# Altium schematic sheet 0257_GPU_GDDR_VCCSAMC_V.SchDoc
size 848 x 558 mm
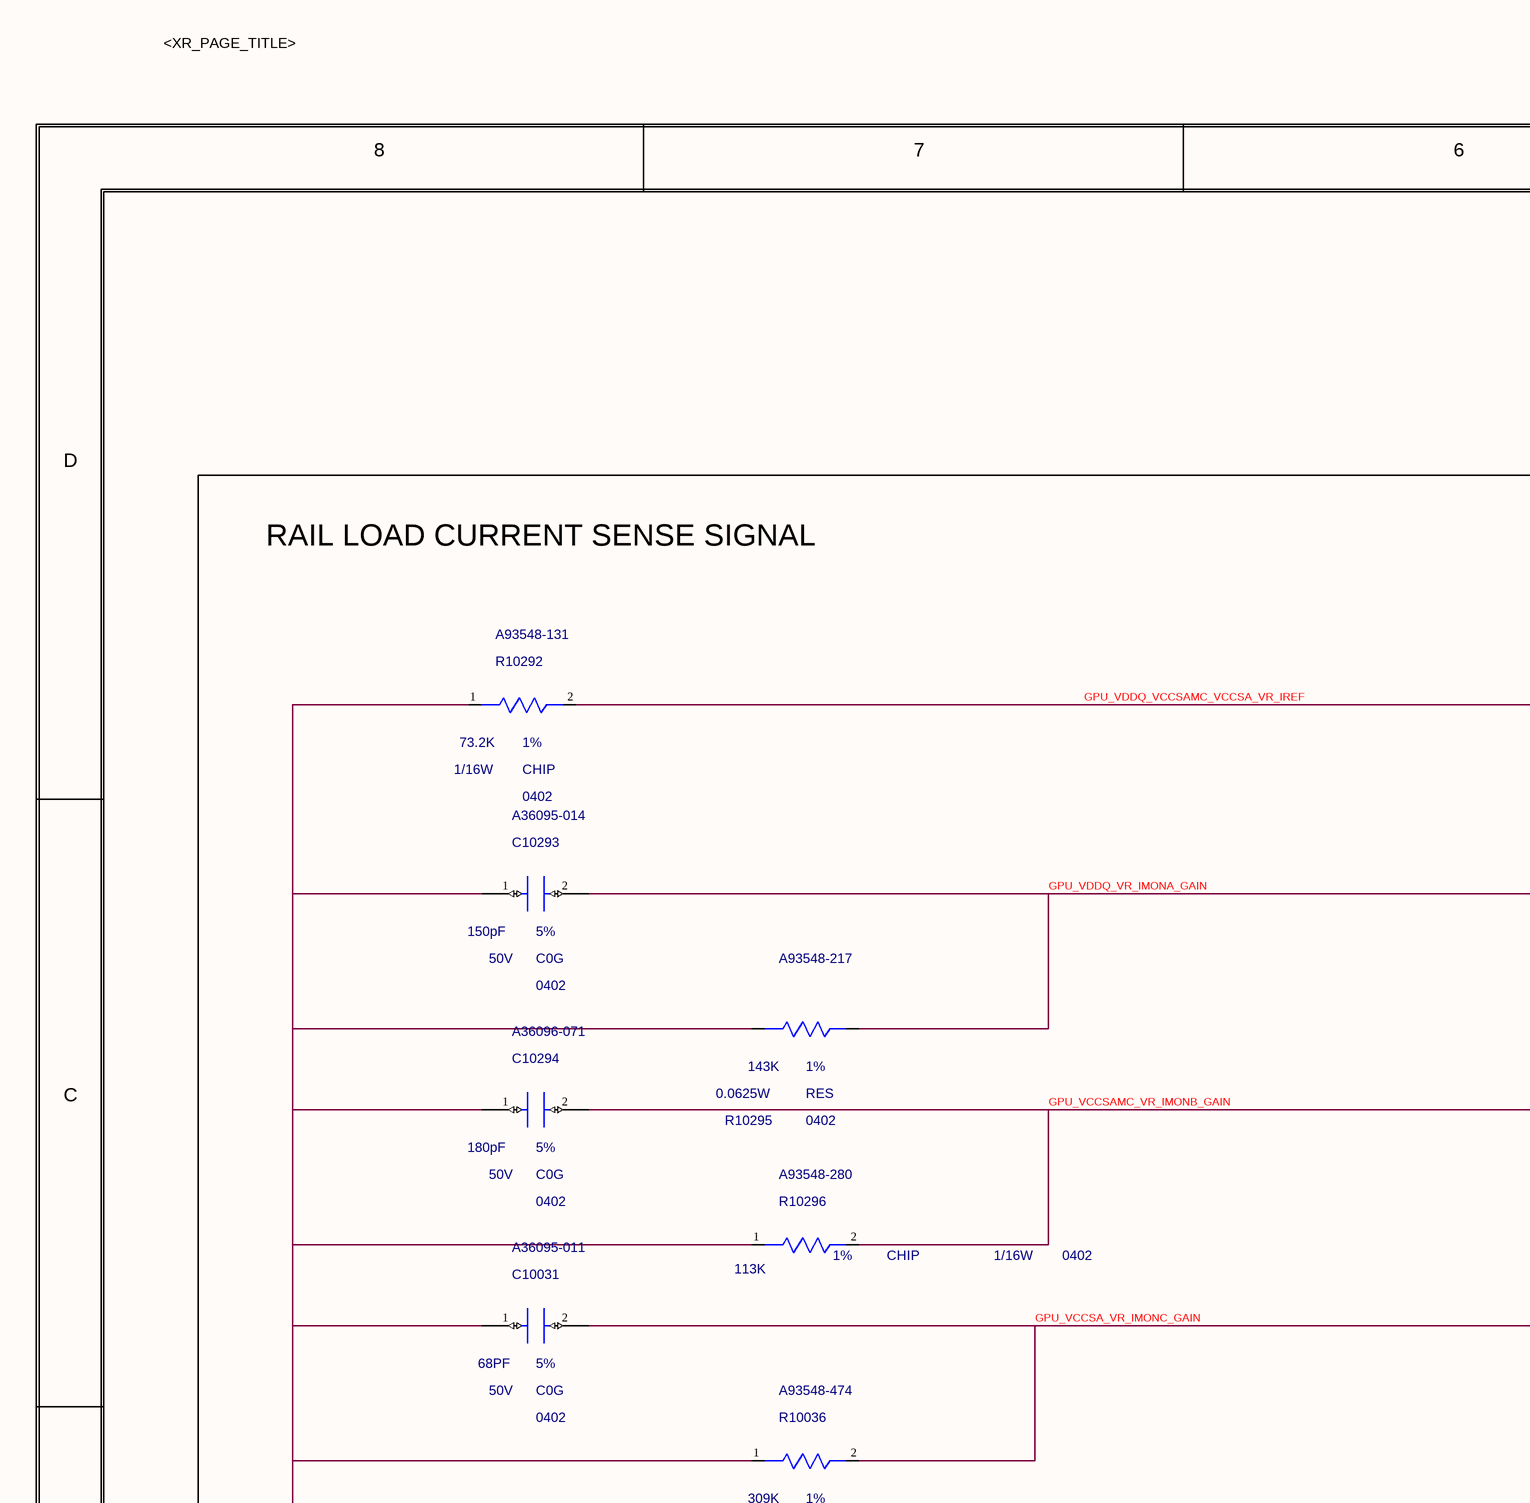
[diagram p0: 0257_GPU_GDDR_VCCSAMC_V.SchDoc, top left]
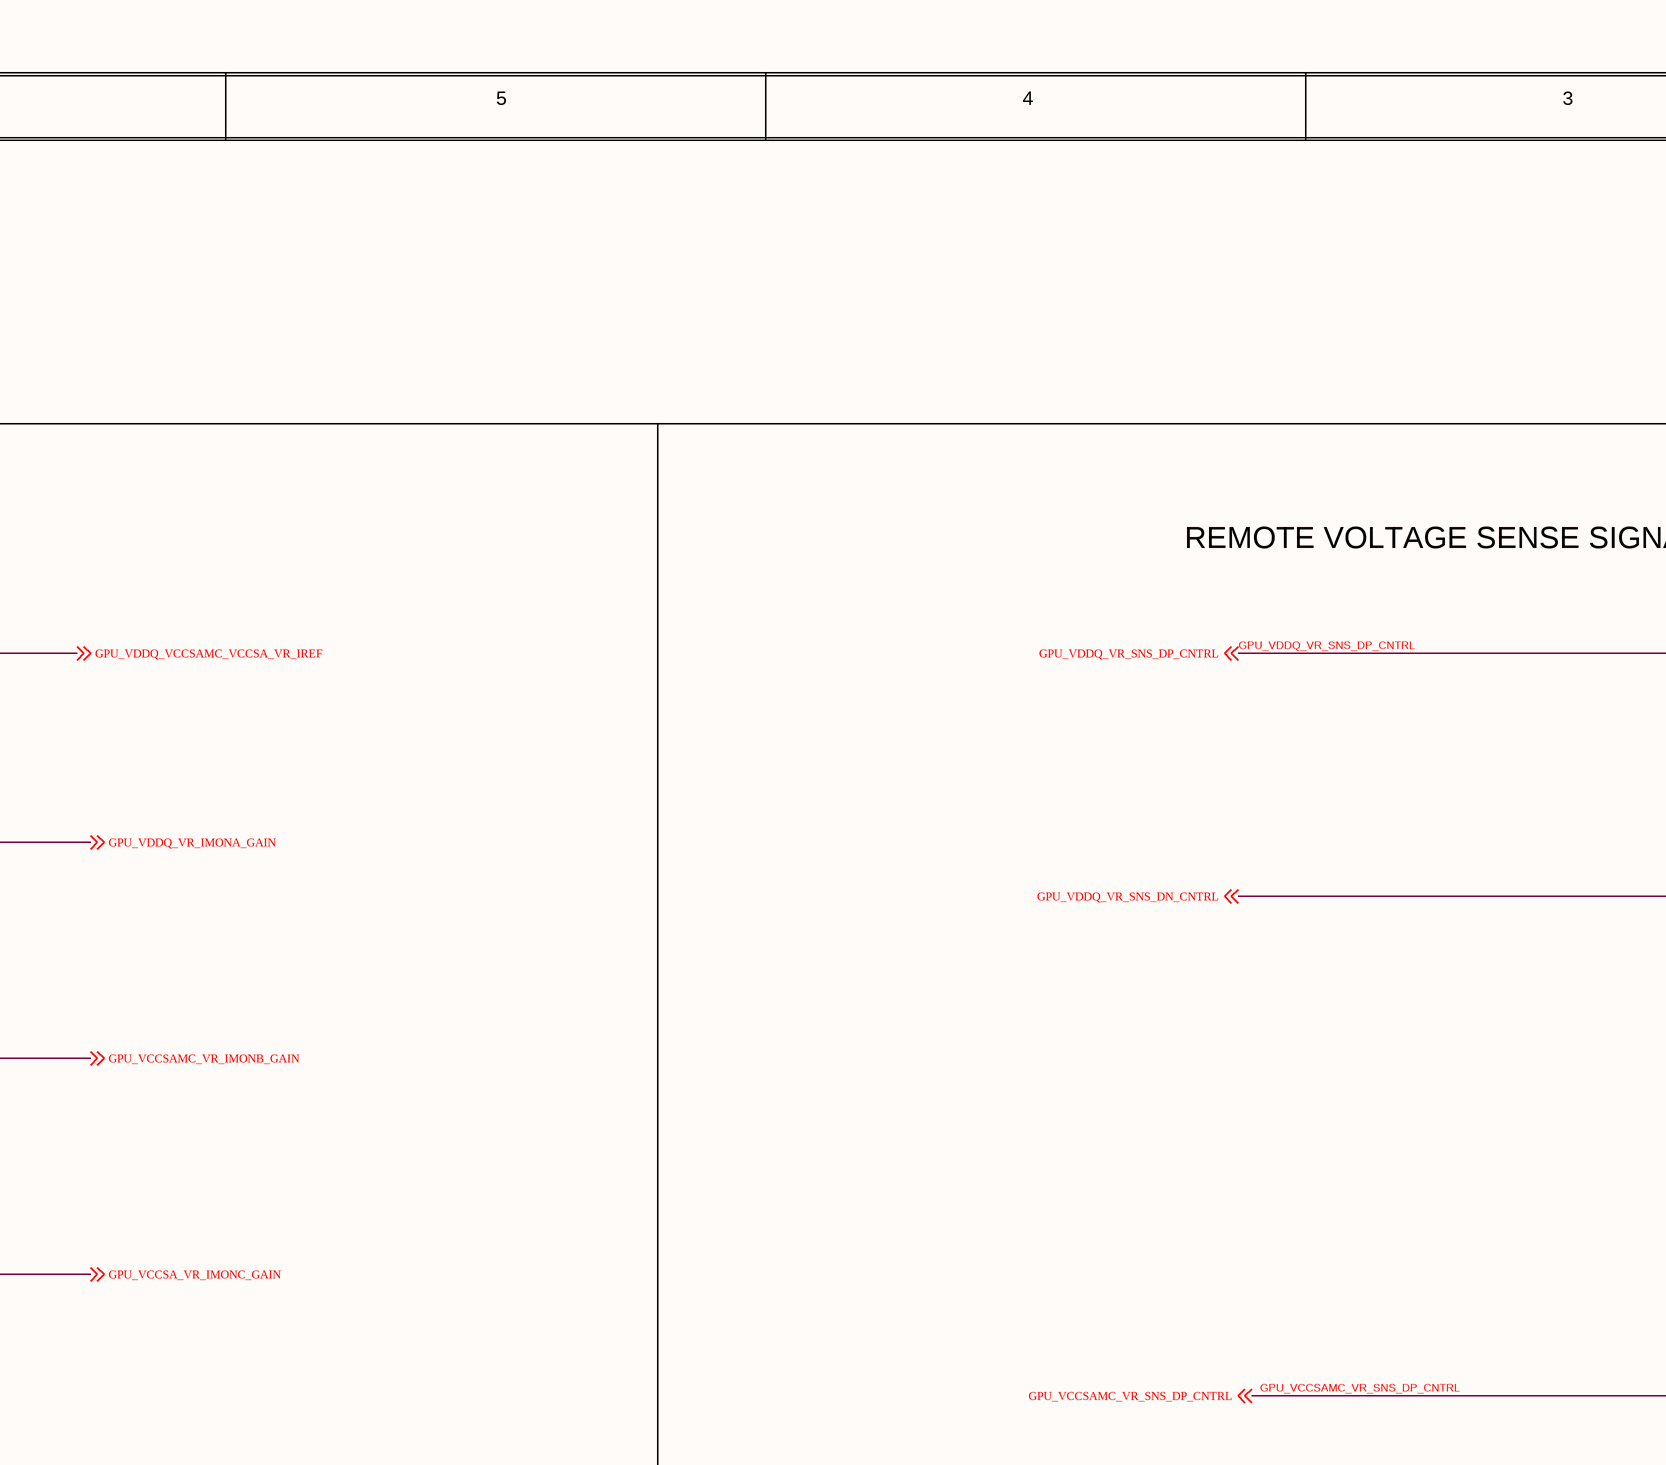
[diagram p1: 0257_GPU_GDDR_VCCSAMC_V.SchDoc, top middle]
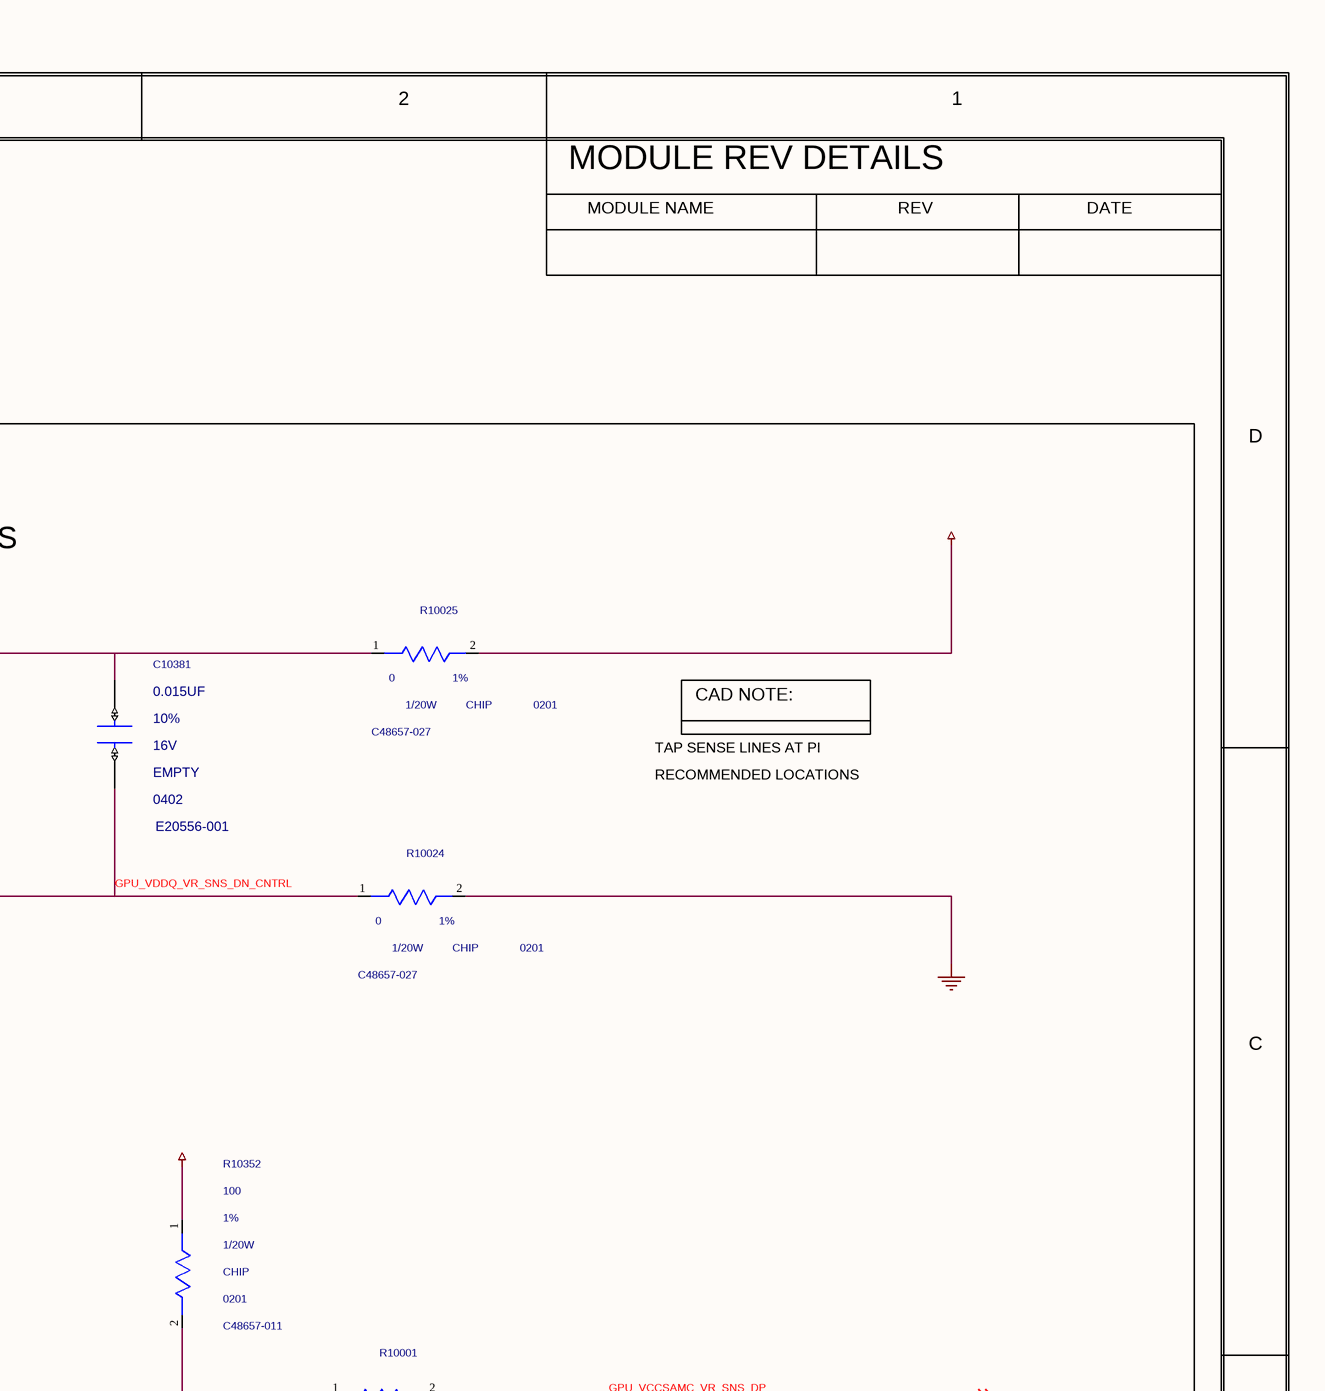
[diagram p2: 0257_GPU_GDDR_VCCSAMC_V.SchDoc, top right]
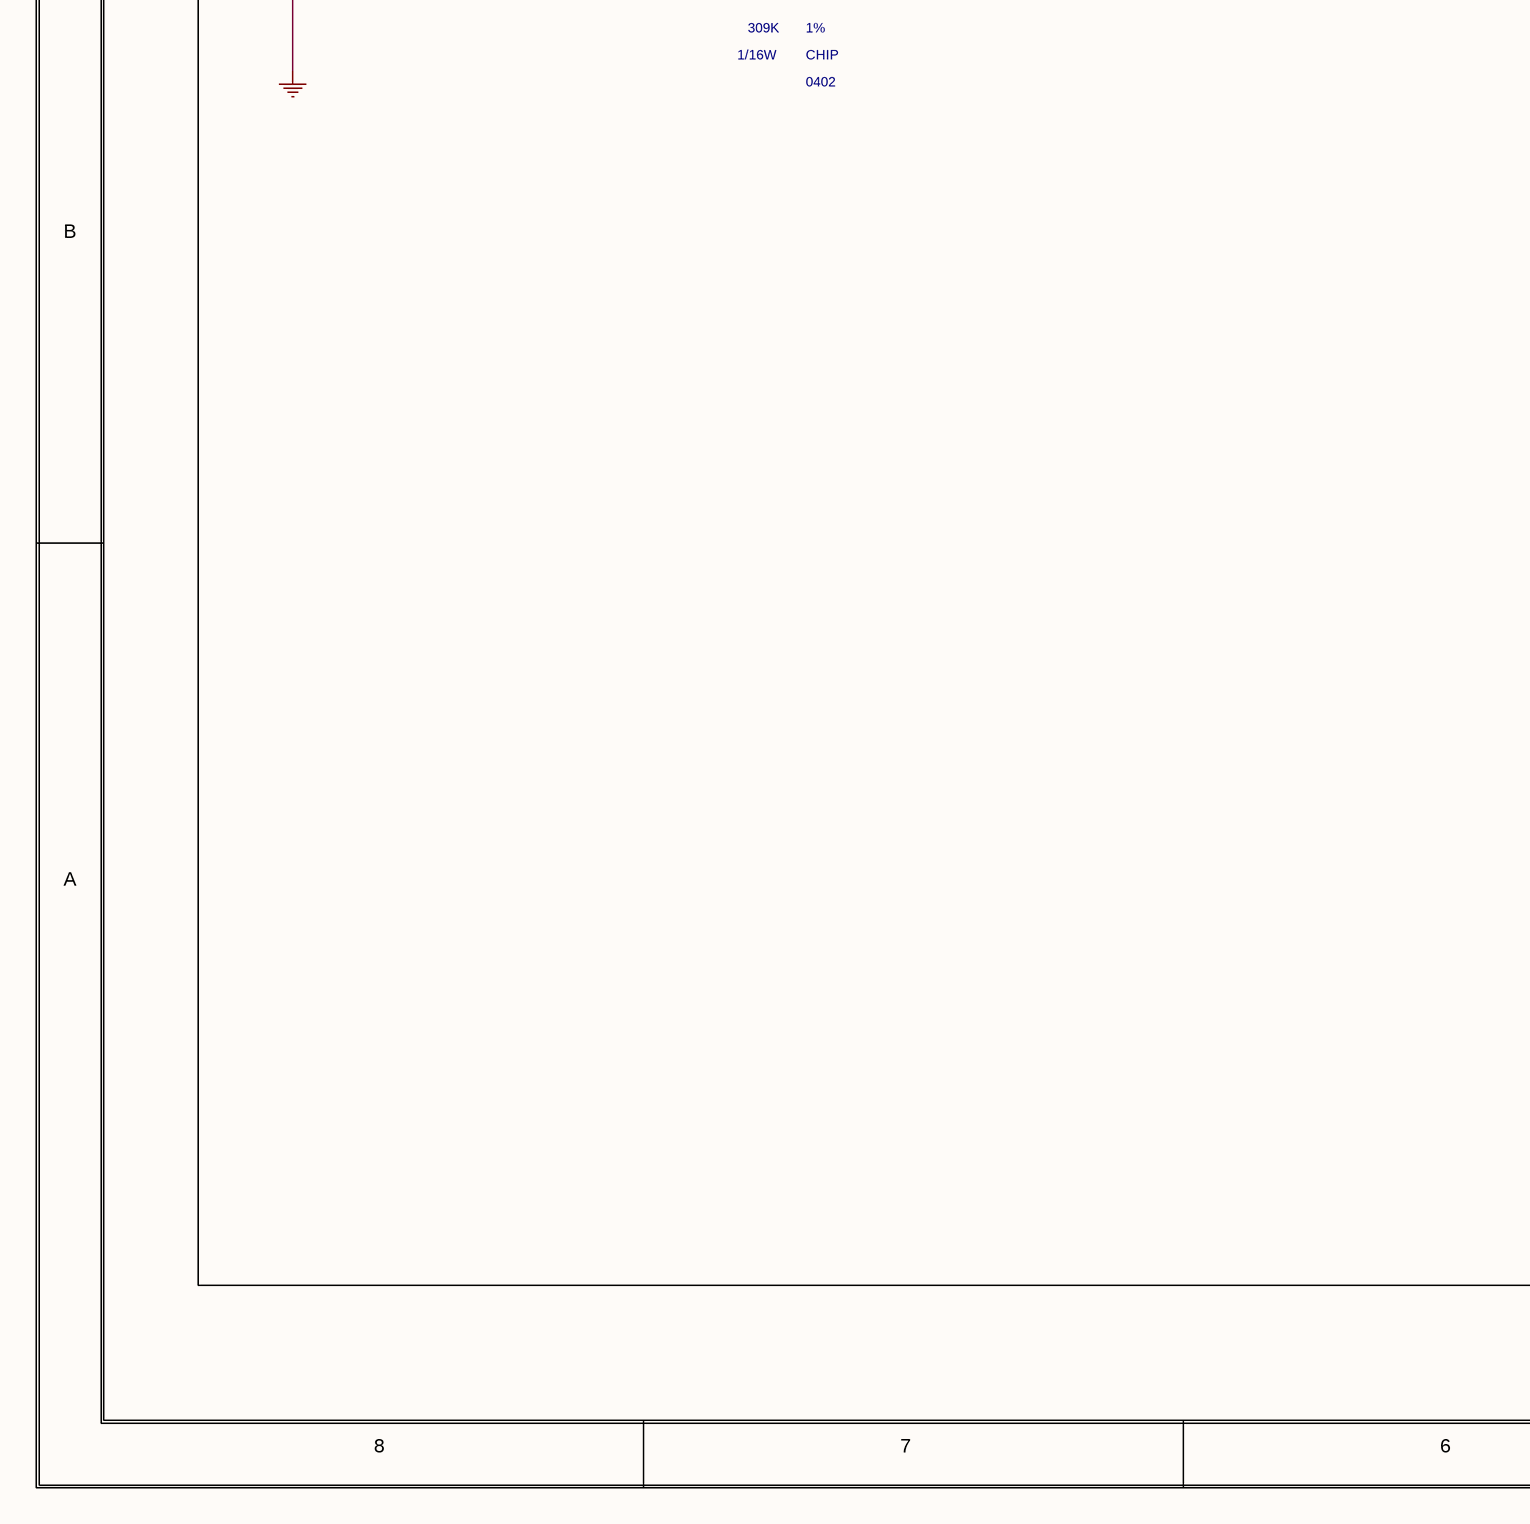
[diagram p3: 0257_GPU_GDDR_VCCSAMC_V.SchDoc, bottom left]
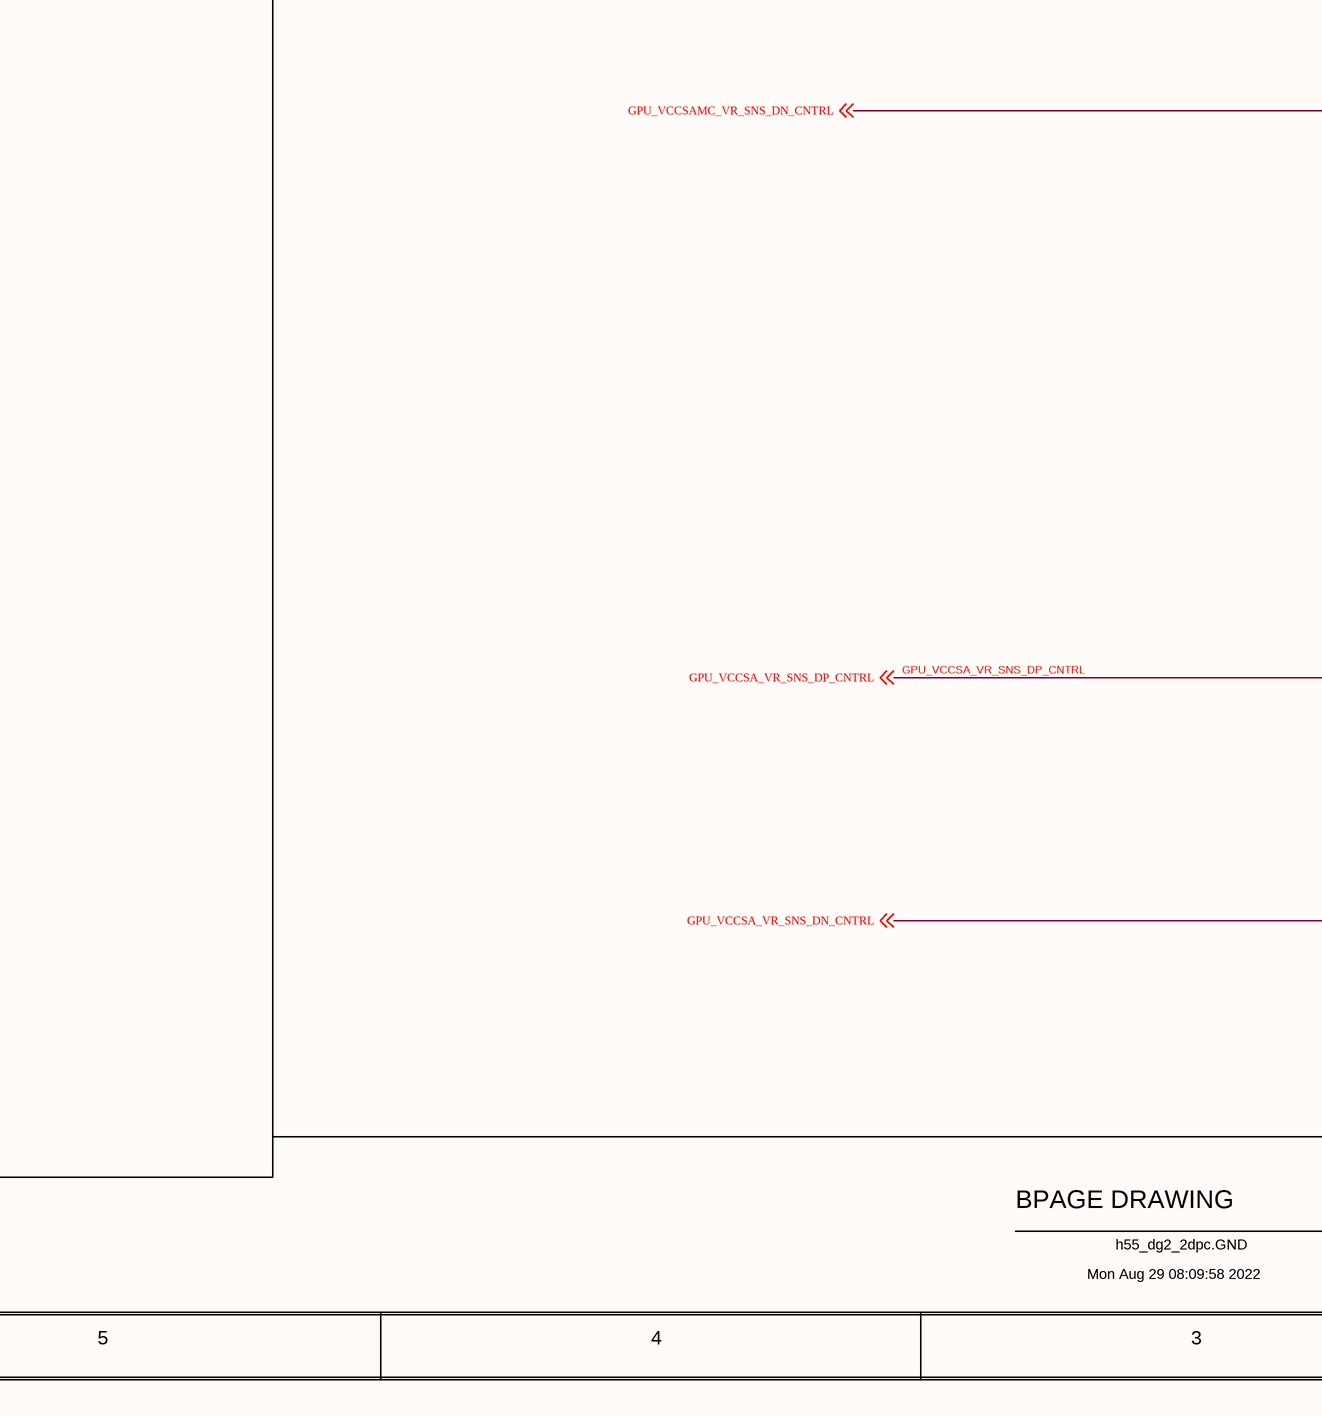
[diagram p4: 0257_GPU_GDDR_VCCSAMC_V.SchDoc, bottom middle]
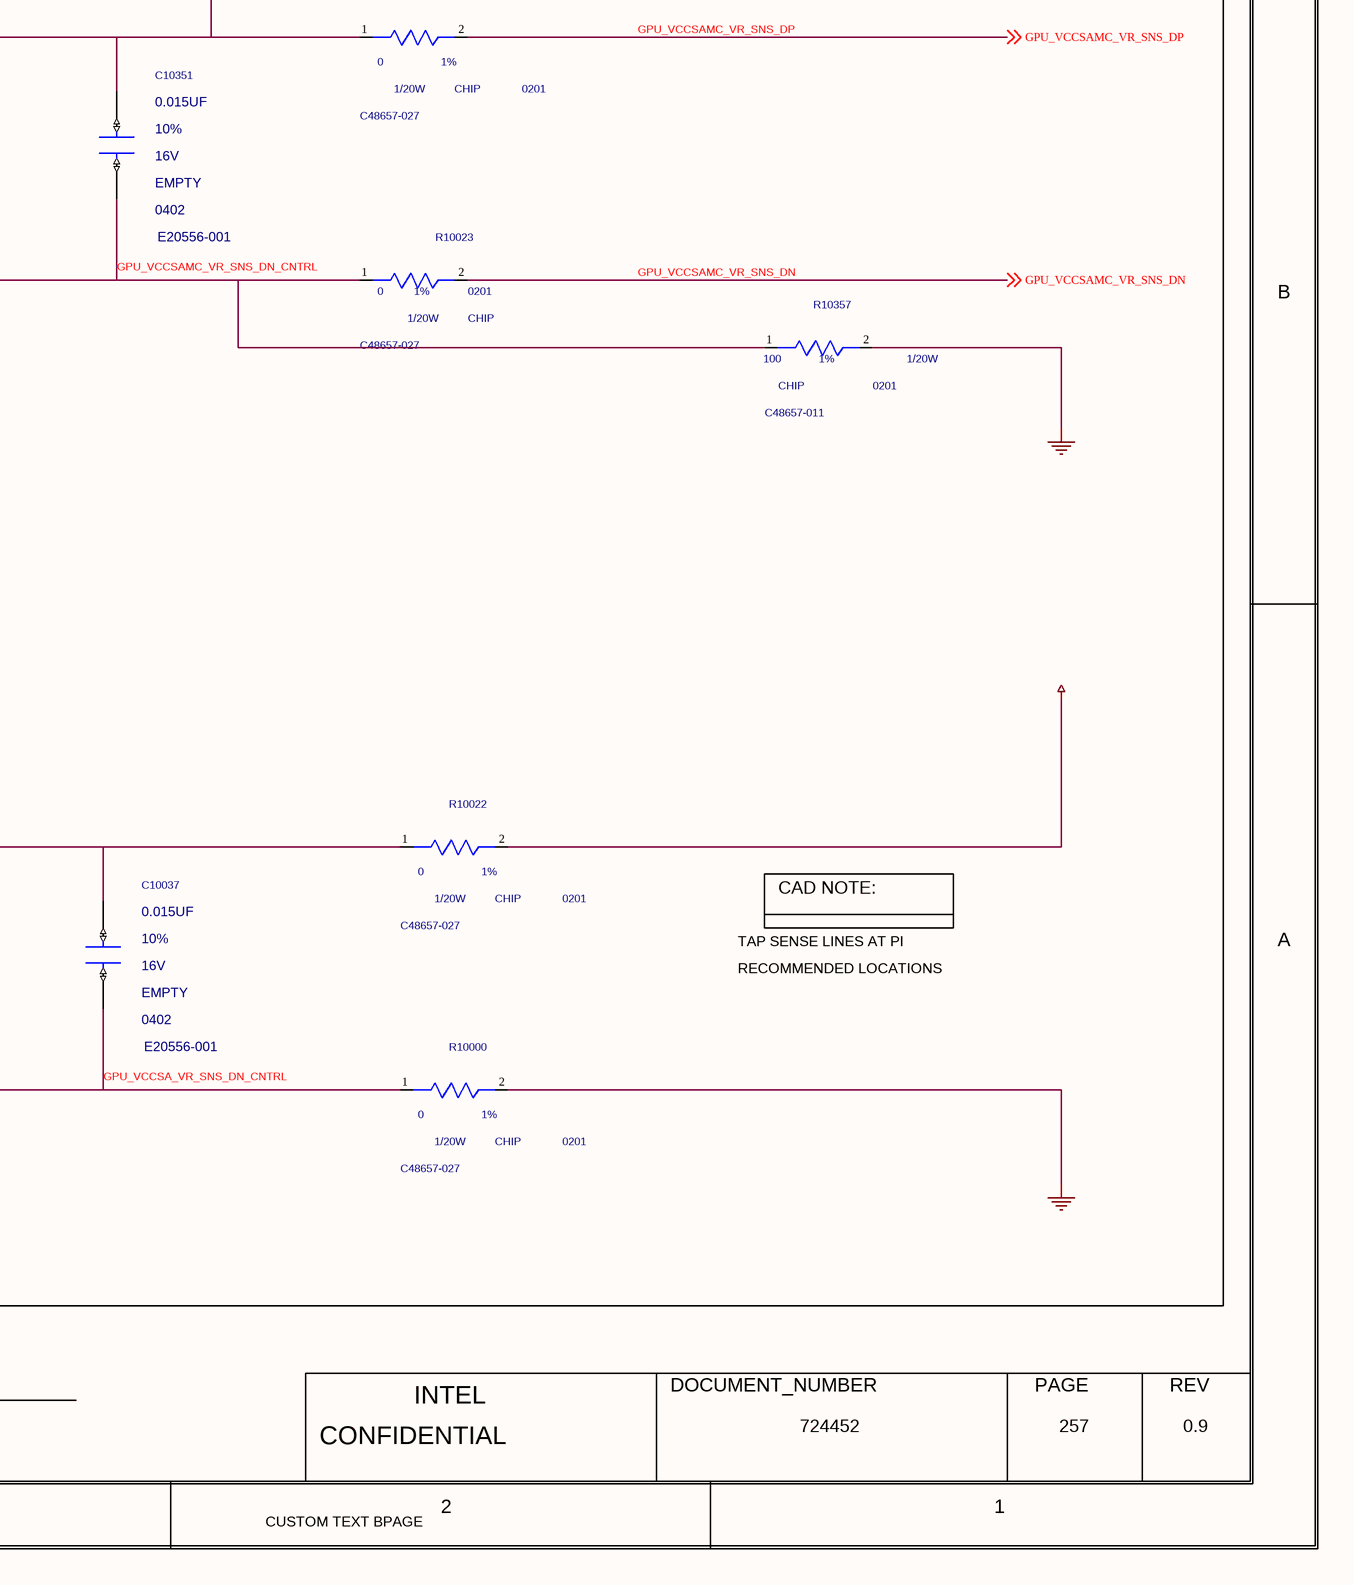
[diagram p5: 0257_GPU_GDDR_VCCSAMC_V.SchDoc, bottom right]

## Parts
C10031  68PF  MATERIAL: C0G  PACK_TYPE: 0402  PART_NUMBER: A36095-011  TOLERANCE: 5%  VOLTAGE: 50V  [SMC0402IA]
C10037  0.015UF  MATERIAL: EMPTY  PACK_TYPE: 0402  PART_NUMBER: E20556-001  TOLERANCE: 10%  VOLTAGE: 16V  [CTK0_SM0402_1050X550_MA]
C10293  150pF  MATERIAL: C0G  PACK_TYPE: 0402  PART_NUMBER: A36095-014  TOLERANCE: 5%  VOLTAGE: 50V  [SMC0402IA]
C10294  180pF  MATERIAL: C0G  PACK_TYPE: 0402  PART_NUMBER: A36096-071  TOLERANCE: 5%  VOLTAGE: 50V  [SMC1005MB]
C10351  0.015UF  MATERIAL: EMPTY  PACK_TYPE: 0402  PART_NUMBER: E20556-001  TOLERANCE: 10%  VOLTAGE: 16V  [CTK0_SM0402_1050X550_MA]
C10381  0.015UF  MATERIAL: EMPTY  PACK_TYPE: 0402  PART_NUMBER: E20556-001  TOLERANCE: 10%  VOLTAGE: 16V  [CTK0_SM0402_1050X550_MA]
R10000  0  MATERIAL: CHIP  PACK_TYPE: 0201  PART_NUMBER: C48657-027  TOLERANCE: 1%  WATTAGE: 1/20W  [SMR0201IA]
R10001  0  MATERIAL: CHIP  PACK_TYPE: 0201  PART_NUMBER: C48657-027  TOLERANCE: 1%  WATTAGE: 1/20W  [SMR0201IA]
R10022  0  MATERIAL: CHIP  PACK_TYPE: 0201  PART_NUMBER: C48657-027  TOLERANCE: 1%  WATTAGE: 1/20W  [SMR0201IA]
R10023  0  MATERIAL: CHIP  PACK_TYPE: 0201  PART_NUMBER: C48657-027  TOLERANCE: 1%  WATTAGE: 1/20W  [SMR0201IA]
R10024  0  MATERIAL: CHIP  PACK_TYPE: 0201  PART_NUMBER: C48657-027  TOLERANCE: 1%  WATTAGE: 1/20W  [SMR0201IA]
R10025  0  MATERIAL: CHIP  PACK_TYPE: 0201  PART_NUMBER: C48657-027  TOLERANCE: 1%  WATTAGE: 1/20W  [SMR0201IA]
R10036  309K  MATERIAL: CHIP  PACK_TYPE: 0402  PART_NUMBER: A93548-474  TOLERANCE: 1%  WATTAGE: 1/16W  [SMR0402IA]
R10292  73.2K  MATERIAL: CHIP  PACK_TYPE: 0402  PART_NUMBER: A93548-131  TOLERANCE: 1%  WATTAGE: 1/16W  [SMR0402IA]
R10295  143K  MATERIAL: RES  PACK_TYPE: 0402  PART_NUMBER: A93548-217  TOLERANCE: 1%  WATTAGE: 0.0625W  [CTK2_SM0402_1100X550_MA]
R10296  113K  MATERIAL: CHIP  PACK_TYPE: 0402  PART_NUMBER: A93548-280  TOLERANCE: 1%  WATTAGE: 1/16W  [SMR0402IA]
R10352  100  MATERIAL: CHIP  PACK_TYPE: 0201  PART_NUMBER: C48657-011  TOLERANCE: 1%  WATTAGE: 1/20W  [SMR0201IA]
R10357  100  MATERIAL: CHIP  PACK_TYPE: 0201  PART_NUMBER: C48657-011  TOLERANCE: 1%  WATTAGE: 1/20W  [SMR0201IA]

## Nets
+VCCSA_GPU: R10022.2(B)
+VCCSAMC_GPU: R10352.1(A)
+VDDQ_GPU: R10025.2(B)
GND: C10031.1(A) C10293.1(A) C10294.1(A) R10000.2(B) R10024.2(B) R10036.1(A) R10292.1(A) R10295.1(A) R10296.1(A) R10357.2(B)
GPU_VCCSA_VR_IMONC_GAIN: C10031.2(B) R10036.2(B) ; off-sheet GPU_VCCSA_VR_IMONC_GAIN
GPU_VCCSA_VR_SNS_DN_CNTRL: C10037.2(B) R10000.1(A) ; off-sheet GPU_VCCSA_VR_SNS_DN_CNTRL
GPU_VCCSA_VR_SNS_DP_CNTRL: C10037.1(A) R10022.1(A) ; off-sheet GPU_VCCSA_VR_SNS_DP_CNTRL
GPU_VCCSAMC_VR_IMONB_GAIN: C10294.2(B) R10296.2(B) ; off-sheet GPU_VCCSAMC_VR_IMONB_GAIN
GPU_VCCSAMC_VR_SNS_DN: R10023.2(B) ; off-sheet GPU_VCCSAMC_VR_SNS_DN
GPU_VCCSAMC_VR_SNS_DN_CNTRL: C10351.2(B) R10023.1(A) R10357.1(A) ; off-sheet GPU_VCCSAMC_VR_SNS_DN_CNTRL
GPU_VCCSAMC_VR_SNS_DP: R10001.2(B) ; off-sheet GPU_VCCSAMC_VR_SNS_DP
GPU_VCCSAMC_VR_SNS_DP_CNTRL: C10351.1(A) R10001.1(A) R10352.2(B) ; off-sheet GPU_VCCSAMC_VR_SNS_DP_CNTRL
GPU_VDDQ_VCCSAMC_VCCSA_VR_IREF: R10292.2(B) ; off-sheet GPU_VDDQ_VCCSAMC_VCCSA_VR_IREF
GPU_VDDQ_VR_IMONA_GAIN: C10293.2(B) R10295.2(B) ; off-sheet GPU_VDDQ_VR_IMONA_GAIN
GPU_VDDQ_VR_SNS_DN_CNTRL: C10381.2(B) R10024.1(A) ; off-sheet GPU_VDDQ_VR_SNS_DN_CNTRL
GPU_VDDQ_VR_SNS_DP_CNTRL: C10381.1(A) R10025.1(A) ; off-sheet GPU_VDDQ_VR_SNS_DP_CNTRL

## Notes on the sheet
- <XR_PAGE_TITLE>
- 8
- 7
- 6
- 5
- 4
- 3
- 2
- 1
- MODULE REV DETAILS
- MODULE NAME
- REV
- DATE
- D
- RAIL LOAD CURRENT SENSE SIGNAL
- REMOTE VOLTAGE SENSE SIGNALS
- CAD NOTE:
- RECOMMENDED LOCATIONS
- TAP SENSE LINES AT PI
- C
- B
- A
- BPAGE DRAWING
- INTEL
- DOCUMENT_NUMBER
- PAGE
- Mon Aug 29 08:09:58 2022
- h55_dg2_2dpc.GND
- CONFIDENTIAL
- 724452
- 257
- 0.9
- CUSTOM TEXT BPAGE

## Library data of the parts
C10031 = CAP#1: CHIPS_PART_NAME: CAP; CDS_PHYS_PART_NAME: CAP_0402-A36095-011,C0G,68PF,50V,5%,LPDB,GENERIC; OriginalSymbolOrigin: (-25,50); XY: (-7200,2850); VER: 2; ROT: 0; PHYS_PAGE: 257; LOCATION: C10031; IP: GENERIC; FP_TECH: LPDB; DRAWING: @RVP1_ADL_SB_ADP_S_DDR5_SODIMM_2DPC_LIB.H55_DG2_2DPC(SCH_1):PAGE420; CDS_LIB: discrete; PCB Footprint: SMC0402IA; CDS_PART_NAME: CAP_0402-A36095-011,C0G,68PF,50V,5%,LPDB,GENERIC; CDS_LOCATION: C10031
C10037 = C_CAP: CDS_PHYS_PART_NAME: C_CAP_0402-E20556-001,EMPTY,0.015UF,16V,10%,TK0,GENERIC; CDS_LMAN_SYM_OUTLINE: -50,50,50,-50; FP_TECH: TK0; IP: GENERIC; ROOM: NONE; OriginalSymbolOrigin: (-50,25); XY: (-2125,925); VER: 1; ROT: 0; PHYS_PAGE: 257; LOCATION: C10037; DRAWING: @RVP1_ADL_SB_ADP_S_DDR5_SODIMM_2DPC_LIB.H55_DG2_2DPC(SCH_1):PAGE420; CDS_LIB: c_discrete; VARIANT: ?; PCB Footprint: CTK0_SM0402_1050X550_MA; CHIPS_PART_NAME: C_CAP; CDS_PART_NAME: C_CAP_0402-E20556-001,EMPTY,0.015UF,16V,10%,TK0,GENERIC; CDS_LOCATION: C10037
C10293 = CAP#1: CHIPS_PART_NAME: CAP; CDS_PHYS_PART_NAME: CAP_0402-A36095-014,C0G,150PF,50V,5%,LPDB,GENERIC; OriginalSymbolOrigin: (-25,50); XY: (-7200,3650); VER: 2; ROT: 0; PHYS_PAGE: 257; LOCATION: C10293; IP: GENERIC; FP_TECH: LPDB; DRAWING: @RVP1_ADL_SB_ADP_S_DDR5_SODIMM_2DPC_LIB.H55_DG2_2DPC(SCH_1):PAGE420; CDS_LIB: discrete; PCB Footprint: SMC0402IA; CDS_PART_NAME: CAP_0402-A36095-014,C0G,150PF,50V,5%,LPDB,GENERIC; CDS_LOCATION: C10293
C10294 = CAP#1: CHIPS_PART_NAME: CAP; CDS_PHYS_PART_NAME: CAP_0402-A36096-071,C0G,180PF,50V,5%,LPDB,GENERIC; OriginalSymbolOrigin: (-25,50); XY: (-7200,3250); VER: 2; ROT: 0; PHYS_PAGE: 257; LOCATION: C10294; IP: GENERIC; FP_TECH: LPDB; DRAWING: @RVP1_ADL_SB_ADP_S_DDR5_SODIMM_2DPC_LIB.H55_DG2_2DPC(SCH_1):PAGE420; CDS_LIB: discrete; PCB Footprint: SMC1005MB; CDS_PART_NAME: CAP_0402-A36096-071,C0G,180PF,50V,5%,LPDB,GENERIC; CDS_LOCATION: C10294
C10351 = C_CAP: CDS_PHYS_PART_NAME: C_CAP_0402-E20556-001,EMPTY,0.015UF,16V,10%,TK0,GENERIC; CDS_LMAN_SYM_OUTLINE: -50,50,50,-50; FP_TECH: TK0; IP: GENERIC; ROOM: NONE; OriginalSymbolOrigin: (-50,25); XY: (-2100,2425); VER: 1; ROT: 0; PHYS_PAGE: 257; LOCATION: C10351; DRAWING: @RVP1_ADL_SB_ADP_S_DDR5_SODIMM_2DPC_LIB.H55_DG2_2DPC(SCH_1):PAGE420; CDS_LIB: c_discrete; VARIANT: ?; PCB Footprint: CTK0_SM0402_1050X550_MA; CHIPS_PART_NAME: C_CAP; CDS_PART_NAME: C_CAP_0402-E20556-001,EMPTY,0.015UF,16V,10%,TK0,GENERIC; CDS_LOCATION: C10351
C10381 = C_CAP: CDS_PHYS_PART_NAME: C_CAP_0402-E20556-001,EMPTY,0.015UF,16V,10%,TK0,GENERIC; CDS_LMAN_SYM_OUTLINE: -50,50,50,-50; FP_TECH: TK0; IP: GENERIC; ROOM: NONE; OriginalSymbolOrigin: (-50,25); XY: (-2050,3850); VER: 1; ROT: 0; PHYS_PAGE: 257; LOCATION: C10381; DRAWING: @RVP1_ADL_SB_ADP_S_DDR5_SODIMM_2DPC_LIB.H55_DG2_2DPC(SCH_1):PAGE420; CDS_LIB: c_discrete; VARIANT: ?; PCB Footprint: CTK0_SM0402_1050X550_MA; CHIPS_PART_NAME: C_CAP; CDS_PART_NAME: C_CAP_0402-E20556-001,EMPTY,0.015UF,16V,10%,TK0,GENERIC; CDS_LOCATION: C10381
R10000 = RES#1: CHIPS_PART_NAME: RES; CDS_PHYS_PART_NAME: RES_0201-C48657-027,CHIP,0,1%,1/20W,LPDB,GENERIC; OriginalSymbolOrigin: (-75,25); XY: (-1475,675); VER: 1; PHYS_PAGE: 257; LOCATION: R10000; DRAWING: @RVP1_ADL_SB_ADP_S_DDR5_SODIMM_2DPC_LIB.H55_DG2_2DPC(SCH_1):PAGE420; CDS_LIB: discrete; PCB Footprint: SMR0201IA; ROT: 0; CDS_PART_NAME: RES_0201-C48657-027,CHIP,0,1%,1/20W,LPDB,GENERIC; CDS_LOCATION: R10000
R10001 = RES#1: CHIPS_PART_NAME: RES; CDS_PHYS_PART_NAME: RES_0201-C48657-027,CHIP,0,1%,1/20W,LPDB,GENERIC; OriginalSymbolOrigin: (-75,25); XY: (-1550,2625); VER: 1; PHYS_PAGE: 257; LOCATION: R10001; DRAWING: @RVP1_ADL_SB_ADP_S_DDR5_SODIMM_2DPC_LIB.H55_DG2_2DPC(SCH_1):PAGE420; CDS_LIB: discrete; PCB Footprint: SMR0201IA; ROT: 0; CDS_PART_NAME: RES_0201-C48657-027,CHIP,0,1%,1/20W,LPDB,GENERIC; CDS_LOCATION: R10001
R10022 = RES#1: CHIPS_PART_NAME: RES; CDS_PHYS_PART_NAME: RES_0201-C48657-027,CHIP,0,1%,1/20W,LPDB,GENERIC; OriginalSymbolOrigin: (-75,25); XY: (-1475,1125); VER: 1; PHYS_PAGE: 257; LOCATION: R10022; DRAWING: @RVP1_ADL_SB_ADP_S_DDR5_SODIMM_2DPC_LIB.H55_DG2_2DPC(SCH_1):PAGE420; CDS_LIB: discrete; PCB Footprint: SMR0201IA; ROT: 0; CDS_PART_NAME: RES_0201-C48657-027,CHIP,0,1%,1/20W,LPDB,GENERIC; CDS_LOCATION: R10022
R10023 = RES#1: CHIPS_PART_NAME: RES; CDS_PHYS_PART_NAME: RES_0201-C48657-027,CHIP,0,1%,1/20W,LPDB,GENERIC; OriginalSymbolOrigin: (-75,25); XY: (-1550,2175); VER: 1; PHYS_PAGE: 257; LOCATION: R10023; DRAWING: @RVP1_ADL_SB_ADP_S_DDR5_SODIMM_2DPC_LIB.H55_DG2_2DPC(SCH_1):PAGE420; CDS_LIB: discrete; PCB Footprint: SMR0201IA; ROT: 0; CDS_PART_NAME: RES_0201-C48657-027,CHIP,0,1%,1/20W,LPDB,GENERIC; CDS_LOCATION: R10023
R10024 = RES#1: CHIPS_PART_NAME: RES; CDS_PHYS_PART_NAME: RES_0201-C48657-027,CHIP,0,1%,1/20W,LPDB,GENERIC; OriginalSymbolOrigin: (-75,25); XY: (-1500,3550); VER: 1; PHYS_PAGE: 257; LOCATION: R10024; DRAWING: @RVP1_ADL_SB_ADP_S_DDR5_SODIMM_2DPC_LIB.H55_DG2_2DPC(SCH_1):PAGE420; CDS_LIB: discrete; PCB Footprint: SMR0201IA; ROT: 0; CDS_PART_NAME: RES_0201-C48657-027,CHIP,0,1%,1/20W,LPDB,GENERIC; CDS_LOCATION: R10024
R10025 = RES#1: CHIPS_PART_NAME: RES; CDS_PHYS_PART_NAME: RES_0201-C48657-027,CHIP,0,1%,1/20W,LPDB,GENERIC; OriginalSymbolOrigin: (-75,25); XY: (-1475,4000); VER: 1; PHYS_PAGE: 257; LOCATION: R10025; DRAWING: @RVP1_ADL_SB_ADP_S_DDR5_SODIMM_2DPC_LIB.H55_DG2_2DPC(SCH_1):PAGE420; CDS_LIB: discrete; PCB Footprint: SMR0201IA; ROT: 0; CDS_PART_NAME: RES_0201-C48657-027,CHIP,0,1%,1/20W,LPDB,GENERIC; CDS_LOCATION: R10025
R10036 = RES#1: CHIPS_PART_NAME: RES; CDS_PHYS_PART_NAME: RES_0402-A93548-474,CHIP,309K,1%,1/16W,LPDB,GENERIC; OriginalSymbolOrigin: (-75,25); XY: (-6700,2600); VER: 1; ROT: 0; PHYS_PAGE: 257; LOCATION: R10036; IP: GENERIC; FP_TECH: LPDB; DRAWING: @RVP1_ADL_SB_ADP_S_DDR5_SODIMM_2DPC_LIB.H55_DG2_2DPC(SCH_1):PAGE420; CDS_LIB: discrete; PCB Footprint: SMR0402IA; CDS_PART_NAME: RES_0402-A93548-474,CHIP,309K,1%,1/16W,LPDB,GENERIC; CDS_LOCATION: R10036
R10292 = RES#1: CHIPS_PART_NAME: RES; CDS_PHYS_PART_NAME: RES_0402-A93548-131,CHIP,73.2K,1%,1/16W,LPDB,GENERIC; OriginalSymbolOrigin: (-75,25); XY: (-7225,4000); VER: 1; ROT: 0; PHYS_PAGE: 257; LOCATION: R10292; IP: GENERIC; FP_TECH: LPDB; DRAWING: @RVP1_ADL_SB_ADP_S_DDR5_SODIMM_2DPC_LIB.H55_DG2_2DPC(SCH_1):PAGE420; CDS_LIB: discrete; PCB Footprint: SMR0402IA; CDS_PART_NAME: RES_0402-A93548-131,CHIP,73.2K,1%,1/16W,LPDB,GENERIC; CDS_LOCATION: R10292
R10295 = C_RES#1: CHIPS_PART_NAME: C_RES; CDS_PHYS_PART_NAME: C_RES_0402-A93548-217,RES,143K,1%,0.0625W,TK2,GENERIC; CDS_LMAN_SYM_OUTLINE: -50,50,50,-50; FP_TECH: TK2; IP: GENERIC; ROOM: NONE; OriginalSymbolOrigin: (-75,25); XY: (-6700,3400); VER: 1; ROT: 0; PHYS_PAGE: 257; LOCATION: R10295; DRAWING: @RVP1_ADL_SB_ADP_S_DDR5_SODIMM_2DPC_LIB.H55_DG2_2DPC(SCH_1):PAGE420; CDS_LIB: c_discrete; VARIANT: ?; PCB Footprint: CTK2_SM0402_1100X550_MA; CDS_PART_NAME: C_RES_0402-A93548-217,RES,143K,1%,0.0625W,TK2,GENERIC; CDS_LOCATION: R10295
R10296 = RES#1: CHIPS_PART_NAME: RES; CDS_PHYS_PART_NAME: RES_0402-A93548-280,CHIP,113K,1%,1/16W,LPDB,GENERIC; OriginalSymbolOrigin: (-75,25); XY: (-6700,3000); VER: 1; ROT: 0; PHYS_PAGE: 257; LOCATION: R10296; IP: GENERIC; FP_TECH: LPDB; DRAWING: @RVP1_ADL_SB_ADP_S_DDR5_SODIMM_2DPC_LIB.H55_DG2_2DPC(SCH_1):PAGE420; CDS_LIB: discrete; PCB Footprint: SMR0402IA; CDS_PART_NAME: RES_0402-A93548-280,CHIP,113K,1%,1/16W,LPDB,GENERIC; CDS_LOCATION: R10296
R10352 = RES: CDS_PHYS_PART_NAME: RES_0201-C48657-011,CHIP,100,1%,1/20W,LPDB,GENERIC; OriginalSymbolOrigin: (-25,75); XY: (-1925,2850); VER: 2; ROT: 0; PHYS_PAGE: 257; LOCATION: R10352; DRAWING: @RVP1_ADL_SB_ADP_S_DDR5_SODIMM_2DPC_LIB.H55_DG2_2DPC(SCH_1):PAGE420; CDS_LIB: discrete; PCB Footprint: SMR0201IA; CHIPS_PART_NAME: RES; CDS_PART_NAME: RES_0201-C48657-011,CHIP,100,1%,1/20W,LPDB,GENERIC; CDS_LOCATION: R10352
R10357 = RES#1: CHIPS_PART_NAME: RES; CDS_PHYS_PART_NAME: RES_0201-C48657-011,CHIP,100,1%,1/20W,LPDB,GENERIC; OriginalSymbolOrigin: (-75,25); XY: (-800,2050); VER: 1; ROT: 0; PHYS_PAGE: 257; LOCATION: R10357; DRAWING: @RVP1_ADL_SB_ADP_S_DDR5_SODIMM_2DPC_LIB.H55_DG2_2DPC(SCH_1):PAGE420; CDS_LIB: discrete; PCB Footprint: SMR0201IA; CDS_PART_NAME: RES_0201-C48657-011,CHIP,100,1%,1/20W,LPDB,GENERIC; CDS_LOCATION: R10357